# EAGLE design syscharge (EAGLE 9.3.1)
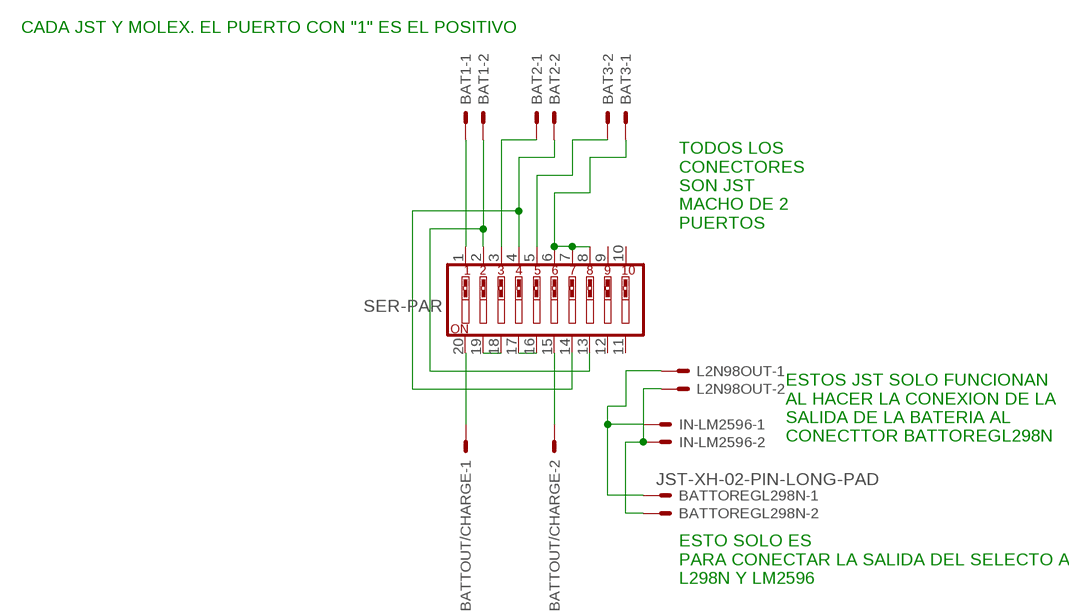
[diagram p0: schematic, sheet 1]

## Parts
BAT1  JST-XH-02-PIN-LONG-PAD  [JST-XH-02-PACKAGE-LONG-PAD]
BAT2  JST-XH-02-PIN-LONG-PAD  [JST-XH-02-PACKAGE-LONG-PAD]
BAT3  JST-XH-02-PIN-LONG-PAD  [JST-XH-02-PACKAGE-LONG-PAD]
BATTOREGL298N  JST-XH-02-PIN-LONG-PAD  [JST-XH-02-PACKAGE-LONG-PAD]
BATTOUT/CHARGE  JST-XH-02-PIN-LONG-PAD  [JST-XH-02-PACKAGE-LONG-PAD]
IN-LM2596  JST-XH-02-PIN-LONG-PAD  [JST-XH-02-PACKAGE-LONG-PAD]
L2N98OUT  JST-XH-02-PIN-LONG-PAD  [JST-XH-02-PACKAGE-LONG-PAD]
SER-PAR  SW_DIP-10  [EDG-10]

## Nets
N$1: BAT1.2 SER-PAR.2 SER-PAR.13
N$2: BAT2.1 SER-PAR.3
N$3: BAT2.2 SER-PAR.4 SER-PAR.14
N$4: BAT3.2 SER-PAR.5
N$5: BATTOUT/CHARGE.2 SER-PAR.15
N$6: SER-PAR.18 SER-PAR.19
N$7: SER-PAR.16 SER-PAR.17
N$8: BAT3.1 SER-PAR.6 SER-PAR.7 SER-PAR.8
N$9: BATTOREGL298N.1 IN-LM2596.1 L2N98OUT.1
N$10: BATTOREGL298N.2 IN-LM2596.2 L2N98OUT.2
N$11: BAT1.1 SER-PAR.1
N$14: BATTOUT/CHARGE.1 SER-PAR.20
Unconnected: SER-PAR.9 SER-PAR.10 SER-PAR.11 SER-PAR.12

## Notes on the sheet
- CADA JST Y MOLEX. EL PUERTO CON "1" ES EL POSITIVO
- TODOS LOS 
  CONECTORES
  SON JST
  MACHO DE 2 
  PUERTOS
- ESTOS JST SOLO FUNCIONAN 
  AL HACER LA CONEXION DE LA
  SALIDA DE LA BATERIA AL 
  CONECTTOR BATTOREGL298N
- ESTO SOLO ES
  PARA CONECTAR LA SALIDA DEL SELECTO AL
  L298N Y LM2596

## Library data of the parts
BAT1-BAT3 BATTOREGL298N BATTOUT/CHARGE IN-LM2596 L2N98OUT = Rembrandt Electronics - JST XH Connectors v1-0:JST-XH-02-PIN: JST XH Connector 2 Pin Wire to board connector. Pitch: 2,54 mm, (0.100") Number of pins: 2 Created by Rembrandt Electronics www.rembrandtelectronics.com
SER-PAR = special:SW_DIP-10: DIP SWITCH

## Net classes
0 optiboardset: width 0.75 mm, drill 2.99 mm, clearance 0.8 mm

## Board
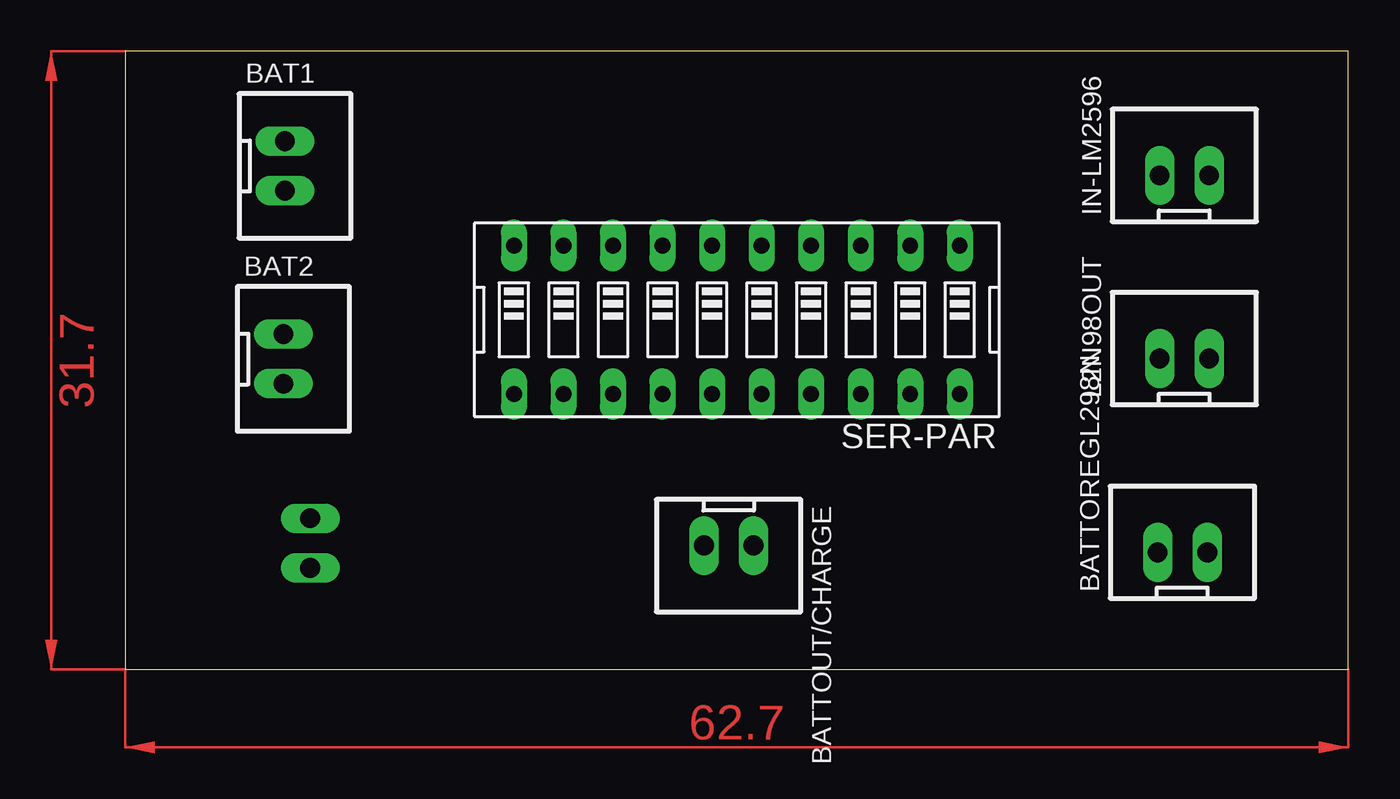
[diagram p1: board, top side]
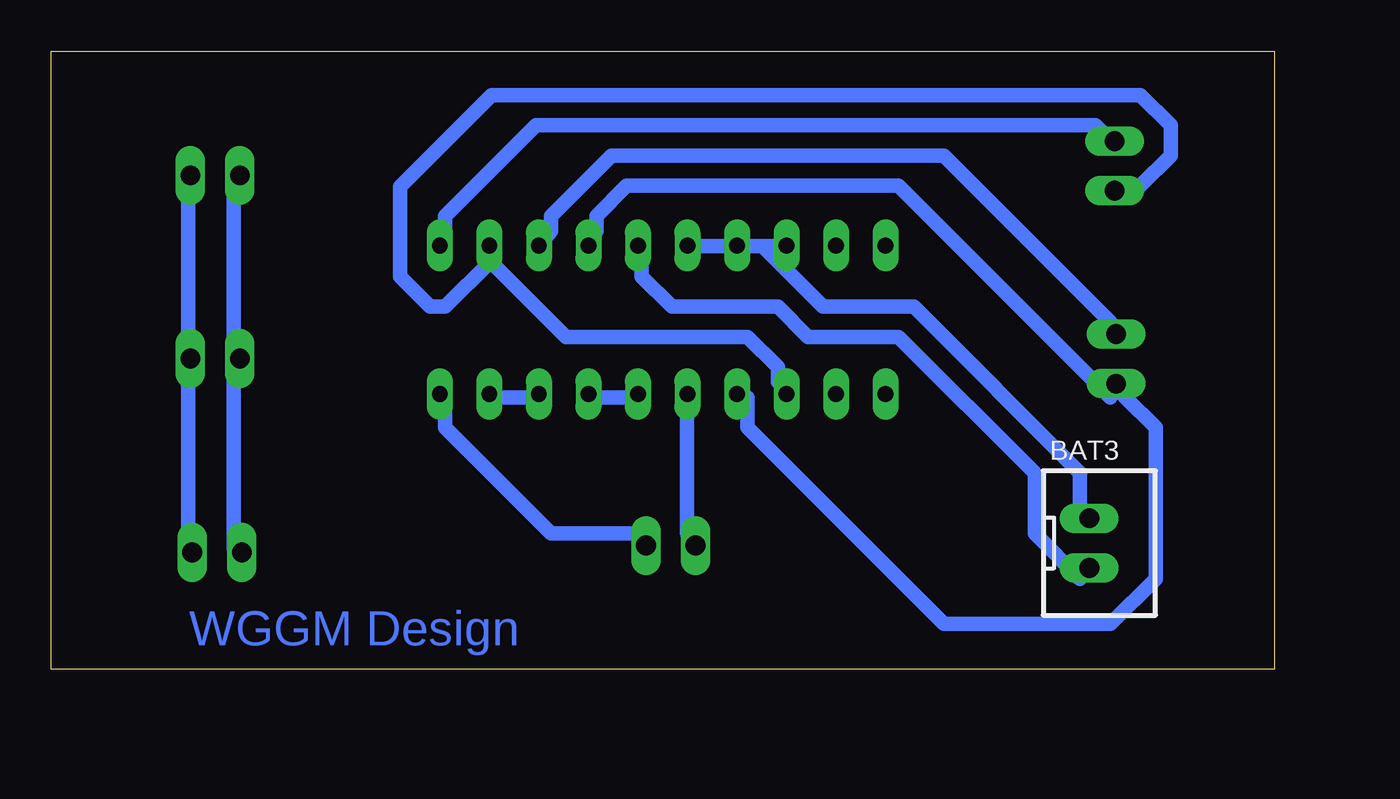
[diagram p2: board, bottom side, seen from below]

Size 62.7 x 31.7 mm. Coordinates in mm from the lower left corner, seen from the top.
Outline: 0,0 62.7,0 62.7,31.7 0,31.7 0,0
Copper layers (1*16): Top 0.035mm / dielectric 1.5mm / Bottom 0.035mm
Design rules "default": minimum track width 6mil, minimum drill 0.35mm, track to track 6mil, track to pad 6mil, pad to pad 6mil, via to via 6mil, smd to smd 6mil, copper to edge 40mil, drill to drill 6mil, minimum pad ring 10mil, minimum via ring 8mil, stop-mask expansion 4mil, vias tented up to drill 0mil, thermal gap 10mil

### Footprints (pad centres in the part's own frame; a part is rotated, then mirrored left to right if it is on the bottom)
JST-XH-02-PACKAGE-LONG-PAD = drill 1.016 long: 1 -1.27,0; 2 1.27,0
EDG-10 = drill 0.813 long: 1 -11.43,-3.81; 2 -8.89,-3.81; 3 -6.35,-3.81; 4 -3.81,-3.81; 5 -1.27,-3.81; 6 1.27,-3.81; 7 3.81,-3.81; 8 6.35,-3.81; 9 8.89,-3.81; 10 11.43,-3.81; 11 11.43,3.81; 12 8.89,3.81; 13 6.35,3.81; 14 3.81,3.81; 15 1.27,3.81; 16 -1.27,3.81; 17 -3.81,3.81; 18 -6.35,3.81; 19 -8.89,3.81; 20 -11.43,3.81

### Placement (x,y rotation side)
BAT1  8.18,25.82 270 top
BAT2  8.1,15.92 270 top
BAT3  9.48,6.48 270 bottom
BATTOREGL298N  54.2,6 0 top
BATTOUT/CHARGE  30.93,6.35 180 top
IN-LM2596  54.3,25.33 0 top
L2N98OUT  54.3,15.94 0 top
SER-PAR  31.35,17.93 180 top

### Tracks (layer width: path | path; a pad name or v marks a point on that pad's centre or on a via)
N$1
  Bottom 0.75: 40.18,20.93 36.3,17.05 27,17.05 25.45,15.5 25.45,14.72 SER-PAR.13 | 40.18,20.93 40.18,21.7 SER-PAR.2 40.18,20.93 | 40.18,20.93 42.5,18.6 43.28,18.6 44.83,20.15 44.83,24.75 40.12,29.45 6.85,29.45 5.3,27.9 5.3,26.35 6.85,24.8 7.62,24.8 BAT1.2
N$2
  Bottom 0.75: SER-PAR.3 37.08,22.48 37.08,23.25 33.98,26.35 16.93,26.35 8.4,17.82 BAT2.1
N$3
  Bottom 0.75: SER-PAR.14 27,13.95 27,12.4 16.93,2.33 8.4,2.33 6.08,4.65 6.08,12.4 7.62,13.95 BAT2.2 8.4,13.95 19.25,24.8 33.2,24.8 34.75,23.25 34.75,22.48 SER-PAR.4
N$4
  Bottom 0.75: SER-PAR.5 32.43,21.7 32.43,20.15 30.88,18.6 25.45,18.6 23.9,17.05 19.25,17.05 12.27,10.07 12.27,6.97 9.95,4.65 BAT3.2
N$5
  Bottom 0.75: SER-PAR.15 30.1,13.95 30.1,6.97 BATTOUT/CHARGE.2
N$6
  Bottom 0.75: SER-PAR.18 37.85,13.95 40.18,13.95 SER-PAR.19
N$7
  Bottom 0.75: SER-PAR.16 33.2,13.95 34.75,13.95 SER-PAR.17
N$8
  Bottom 0.75: 26.22,21.7 27,21.7 SER-PAR.7 27.77,21.7 30.1,21.7 SER-PAR.6 | 26.22,21.7 25.45,21.7 SER-PAR.8 | 26.22,21.7 23.12,18.6 18.47,18.6 9.95,10.07 9.95,7.75 BAT3.1
N$9
  Bottom 0.75: BATTOREGL298N.1 53.35,6.2 53.35,15.5 L2N98OUT.1 53.35,16.27 53.35,24.8 IN-LM2596.1
N$10
  Bottom 0.75: BATTOREGL298N.2 55.68,6.2 55.68,15.5 L2N98OUT.2 55.68,16.27 55.68,24.8 IN-LM2596.2
N$11
  Bottom 0.75: SER-PAR.1 42.5,22.48 42.5,23.25 37.85,27.9 9.18,27.9 8.4,27.12 BAT1.1
N$14
  Bottom 0.75: SER-PAR.20 42.5,13.95 42.5,12.4 37.08,6.97 32.43,6.97 BATTOUT/CHARGE.1
(copper drawn outside any net)
  shapes: Top area x2

### Text on the board
Bottom: WGGM Design